# Altium schematic sheet USB.SchDoc
size A4; SheetNumber: 2; SheetTotal: 2
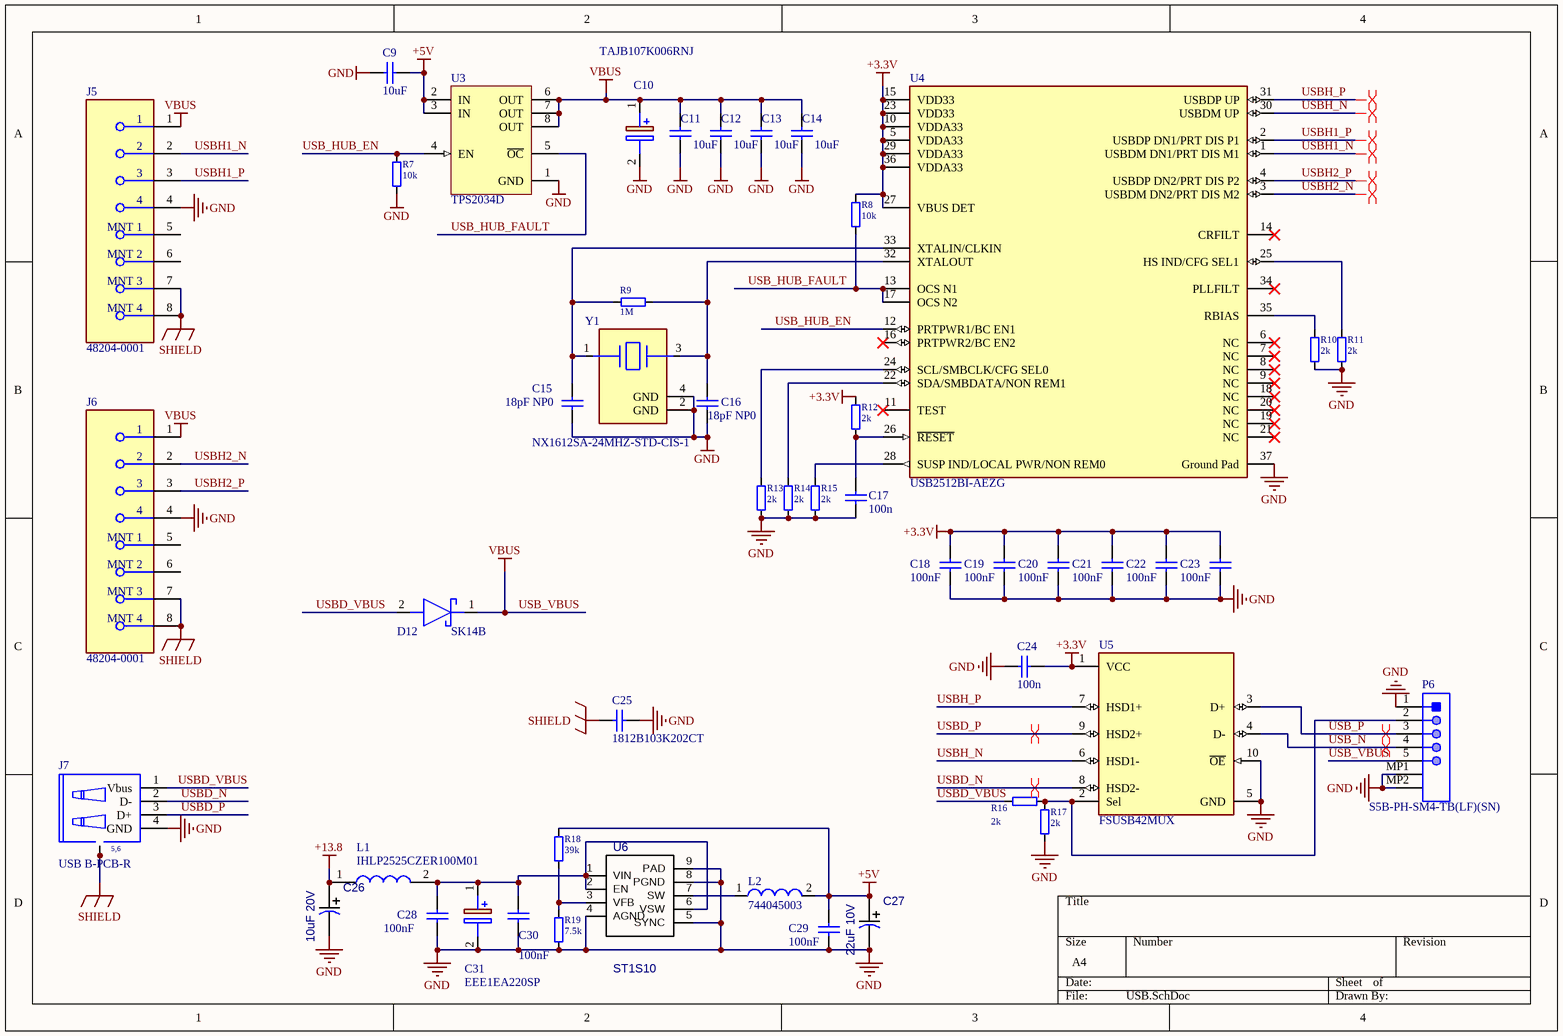
[diagram p0: USB.SchDoc]

## Parts
C9  10uF  [C-0805]
C10  TAJB107K006RNJ  [CAPPM3528X210N]
C11  10uF  [C-0805]
C12  10uF  [C-0805]
C13  10uF  [C-0805]
C14  10uF  [C-0805]
C15  18pF NP0  [C-0805]
C16  18pF NP0  [C-0805]
C17  100n  [C-0805]
C18  100nF  [C-0805]
C19  100nF  [C-0805]
C20  100nF  [C-0805]
C21  100nF  [C-0805]
C22  100nF  [C-0805]
C23  100nF  [C-0805]
C24  100n  [C-0805]
C25  1812B103K202CT  [CAPC4632X280X75LL50T35]
C26  10uF 20V  [CAPAE_4.3x4.3h5.4]
C27  22uF 10V  [CAPAE_4.3x4.3h5.4]
C28  100nF  [C-0805]
C29  100nF  [C-0805]
C30  100nF  [C-0805]
C31  EEE1EA220SP  [EEE1AA101SP]
D12  SK14B  [DIOM5236X261N]
J5  48204-0001  [FP-48204-0001-MFG]
J6  48204-0001  [FP-48204-0001-MFG]
J7  USB B-PCB-R  [USB_B_PCB_R]
L1  IHLP2525CZER100M01  [INDPM6965X300N]
L2  744045003  [WE-LQ-L]
P6  S5B-PH-SM4-TB(LF)(SN)  [JST-S5B-PH-SM4-TB_V]
R7  10k  [R-0805]
R8  10k  [R-0805]
R9  1M  [R-0805]
R10  2k  [R-0805]
R11  2k  [R-0805]
R12  2k  [R-0805]
R13  2k  [R-0805]
R14  2k  [R-0805]
R15  2k  [R-0805]
R16  2k  [R-0805]
R17  2k  [R-0805]
R18  39k  [R-0805]
R19  7.5k  [R-0805]
U3  TPS2034D  [D0008A_N]
U4  USB2512BI-AEZG  [FP-USB2512BI-AEZG-MFG]
U5  FSUSB42MUX  [FP-846AP-MFG]
U6  ST1S10  [ST1S10]
Y1  NX1612SA-24MHZ-STD-CIS-1  [FP-NX3225GA-MFG]

## Nets
+3.3V: C18.1 C19.1 C20.1 C21.1 C22.1 C23.1 C24.2 R8.1 R12.2 U4.5(VDDA33) U4.10(VDDA33) U4.15(VDD33) U4.23(VDD33) U4.27(VBUS_DET) U4.29(VDDA33) U4.36(VDDA33) U5.1(VCC)
+5V: C9.1 C27.1(PLUS) C29.1 L2.2 R18.1 U3.2(IN) U3.3(IN)
+13.8: C26.1(PLUS) L1.1
GND: C9.2 C10.2(-) C11.2 C12.2 C13.2 C14.2 C15.1 C16.1 C17.1 C18.2 C19.2 C20.2 C21.2 C22.2 C23.2 C24.1 C25.2 C26.2(MINUS) C27.2(MINUS) C28.2 C29.2 C30.2 C31.2(-) J5.4 J6.4 J7.4(GND) P6.1 P6.MP1 P6.MP2 R7.1 R10.1 R11.1 R13.1 R14.1 R15.1 R17.1 R19.2 U3.1(GND) U4.37(Ground_Pad) U5.5(GND) U5.10(~{OE}) U6.4(AGND) U6.5(SYNC) U6.8(PGND) U6.9(PAD) Y1.2(GND) Y1.4(GND)
SHIELD: C25.1 J5.7(MNT_3) J5.8(MNT_4) J6.7(MNT_3) J6.8(MNT_4) J7.5 J7.6
USB_VBUS: C10.1(+) C11.1 C12.1 C13.1 C14.1 D12.1(K) J5.1 J6.1 P6.5 U3.6(OUT) U3.7(OUT) U3.8(OUT)  [also labelled VBUS]
USB_HUB_EN: R7.2 U3.4(EN) U4.12(PRTPWR1/BC_EN1)
USB_HUB_FAULT: R8.2 U3.5(~{OC}) U4.13(OCS_N1) U4.17(OCS_N2)
USB_N: P6.4 U5.4(D-)
USB_P: P6.3 U5.3(D+)
USBD_N: J7.2(D-) U5.8(HSD2-)
USBD_P: J7.3(D+) U5.9(HSD2+)
USBD_VBUS: D12.2(A) J7.1(Vbus) R16.2
USBH1_N: J5.2 U4.1(USBDM_DN1/PRT_DIS_M1)
USBH1_P: J5.3 U4.2(USBDP_DN1/PRT_DIS_P1)
USBH2_N: J6.2 U4.3(USBDM_DN2/PRT_DIS_M2)
USBH2_P: J6.3 U4.4(USBDP_DN2/PRT_DIS_P2)
USBH_N: U4.30(USBDM_UP) U5.6(HSD1-)
USBH_P: U4.31(USBDP_UP) U5.7(HSD1+)
NetC15_2: C15.2 R9.2 U4.33(XTALIN/CLKIN) Y1.1
NetC16_2: C16.2 R9.1 U4.32(XTALOUT) Y1.3
NetC17_2: C17.2 R12.1 U4.26(~{RESET})
NetC28_1: C28.1 C30.1 C31.1(+) L1.2 U6.1(VIN) U6.2(EN) U6.6(VSW)
NetL2_1: L2.1 U6.7(SW)
NetP6_2: P6.2 R16.1 R17.2 U5.2(Sel)
NetR10_2: R10.2 U4.35(RBIAS)
NetR11_2: R11.2 U4.25(HS_IND/CFG_SEL1)
NetR13_2: R13.2 U4.24(SCL/SMBCLK/CFG_SEL0)
NetR14_2: R14.2 U4.22(SDA/SMBDATA/NON_REM1)
NetR15_2: R15.2 U4.28(SUSP_IND/LOCAL_PWR/NON_REM0)
NetR18_2: R18.2 R19.1 U6.3(VFB)

Not connected (* = marked no-connect by the designer): J5 5(MNT_1) 6(MNT_2); J6 5(MNT_1) 6(MNT_2); U4 6(NC)* 7(NC)* 8(NC)* 9(NC)* 11(TEST)* 14(CRFILT)* 16(PRTPWR2/BC_EN2)* 18(NC)* 19(NC)* 20(NC)* 21(NC)* 34(PLLFILT)*

## Layout directives
differential pair: USB_N, USB_P, USBD_N, USBD_P, USBH1_N, USBH1_P, USBH2_N, USBH2_P, USBH_N, USBH_P

## Notes on the sheet
- (in symbol Conn USB 4P) 5,6

## Library data of the parts
C9 C11-C24 C28-C30 = C semi: Ceramic Multilayer Capacitor; Manufacturer: Yageo/Phycomp; Manufacturer P/N: CC0603JRNPO9BN102; numsch: 011; TypeNum: 155; Parameters: 1nF, NP0, 50V, ±5%; Tolerance: ±10%; Voltage: *
C10 = TAJB107K006RNJ: Capacitor Polarised; Manufacturer_Name: AVX; Datasheet Link: http://datasheets.avx.com/TAJ.pdf; Height: 2.1mm; Manufacturer_Part_Number: TAJB107K006RNJ; Mouser Part Number: 581-TAJB107K006R; Mouser Price/Stock: https://www.mouser.co.uk/ProductDetail/AVX/TAJB107K006RNJ?qs=fdqkYiOtZpcsxthKdBMg8Q%3D%3D; Arrow Part Number: TAJB107K006RNJ; Arrow Price/Stock: https://www.arrow.com/en/products/tajb107k006rnj/avx?region=nac
C25 = CMP-2000-05506-1: X7R ±10% 2kV 10nF 1812 Multilayer Ceramic Capacitors MLCC - SMD/SMT ROHS; Manufacturer: AVX; Rated Voltage: 1000V; Mounting Technology: SurfaceMount; Datasheet Version: 01/2016; Package Description: 2-Pin Surface Mount Device, Body 4.6 x 3.2 mm; Capacitance: 10nF; Dielectric: X7R; Manufacturer URL: http://www.avx.com/; Case Size/Dimension: 1812; Datasheet URL: http://datasheets.avx.com/HV-FlexitermMLCC.pdf; Package Reference: 1812; Tolerance (%): ±10%
C26 C27 = CAPAE_4.3x4.3h5.4
  C26: Value: 10uF 20V
  C27: Value: 22uF 10V
C31 = EEE1EA220SP: Capacitor Polarised; Manufacturer_Name: Panasonic; Datasheet Link: http://industrial.panasonic.com/cdbs/www-data/pdf/RDE0000/ABA0000C1145.pdf; Height: 7.8mm; Manufacturer_Part_Number: EEE1EA220SP
D12 = SK14B: Schottky Diode; Manufacturer_Name: Taiwan Semiconductor; Datasheet Link: https://datasheet.datasheetarchive.com/originals/distributors/Datasheets-35/DSA-697770.pdf; Height: 2.61mm; Manufacturer_Part_Number: SK14B; Mouser Part Number: 821-SK14B; Mouser Price/Stock: https://www.mouser.co.uk/ProductDetail/Taiwan-Semiconductor/SK14B?qs=tHU%2FlV7kTyTJWY0R1AZI9A%3D%3D
J5 J6 = CMP-0411-00001-3: CONN RCPT USB2.0 TYPEA 4POS R/A; Max Voltage Rating (DC): 3.03kV; Number of Contacts: 4; Current Rating: 1.5A; Voltage Rating: 30V; Connector Type: USB; Insulation Resistance: 1GR; Number of Ports: 1; Gender: Female; Pitch: 2mm; Min Operating Temperature: -55°C; Series: 48204; Number of Rows: 3; Length: 7.2mm; Package Quantity: 60; Contact Plating: Bronze; Termination: Solder; Voltage Rating (AC): 30V; Max Voltage Rating (AC): 30V; Depth: 19.25mm; Number of Circuits: 4; Flammability Rating: UL94 V-0; Contact Material: Tin; Housing Material: Polyester; Packaging: Tray; Color: Black; Orientation: Right Angle; Radiation Hardening: No; Number of Terminals/Pins: 4; Features: Shielded; Max Operating Temperature: 85°C; Weight: 0.09524oz
J7 = Conn USB 4P: Connector USB B-PCB-90 deg; Manufacturer: SST; Manufacturer P/N: USB-001-B; TypeNum: 820; Manufacturer No: *; Manufacturer No2: *; Manufacturer Link: *; Parameters: *
L1 = IHLP2525CZER100M01: Inductor; Manufacturer_Name: Vishay; Datasheet Link: https://www.vishay.com/docs/34104/ihlp-2525cz-01.pdf; Height: 3mm; Manufacturer_Part_Number: IHLP2525CZER100M01; Mouser Part Number: 70-IHLP2525CZER100M0; Mouser Price/Stock: https://www.mouser.co.uk/ProductDetail/Vishay-Dale/IHLP2525CZER100M01?qs=PA%252BPfIdQ8xl3JLrMc5InbA%3D%3D; Arrow Part Number: IHLP2525CZER100M01; Arrow Price/Stock: https://www.arrow.com/en/products/ihlp2525czer100m01/vishay?region=nac
L2 = CMP-0227-00587-1: SMD-RF-Inductor WE-LQ, L = 3.30 µH; Inductance: 3.30 ÂµH; ComponentLink2URL: http://www.we-online.de/katalog/media/pdf/744045003.pdf; ComponentLink2Description: Datasheet; PackageDescription: Inductor, 2-Leads, Body 4.5 x 3.2 mm; PackageReference: WE-LQ-L; DatasheetVersion: ver 3, Jul-2006; ComponentLink1URL: http://www.we-online.com; ComponentLink1Description: Manufacturer Link; PackageVersion: 2006
P6 = CMP-2000-07026-1: Male Header, Pitch 2 mm, 1 x 5 Position, Height 5.5 mm, -25 to 85 degC, RoHS, Tape and Reel; Manufacturer: JST; No of Positions: 5; Pitch: 2mm; Style/Orientation: RightAngleHeader/Plug; Manufacturer URL: http://www.jst.com/home2.html; Datasheet URL: http://www.jst-mfg.com/product/pdf/eng/ePH.pdf; Termination: Crimp; Mounting Technology: SurfaceMount; Package Reference: S5B-PH-SM4-TB; Type: WiretoBoard; Datasheet Version: 12/2012; Package Description: Male Header, Pitch 2 mm, 1 x 5 Position, Height 5.5 mm
R7-R19 = RES semi: Chip Resistor; Manufacturer: Yageo/Phycomp; Manufacturer P/N: RC0603FR-0749R9L; numsch: 021; TypeNum: 212; Parameters: 49.9R, RC, 0.1W, ±1%, TCR ±100ppm; Power: *; TCR: *; Series: *; Tolerance: *
U3 = CMP-0337-00092-2: 2.2 A, 2.7 to 5.5 V Single Hot-Swap IC Hi-Side MOSFET, Fault Report, Act-High Enable, 33 mOhms, -40 to 85 degC, 8-pin SOIC (D), Green (RoHS & no Sb/Br); Manufacturer: Texas Instruments; Enable: Active High; Number of Switches: 1; Vin(Max)(V): 5.5; Rating: Catalog; Vin(Min)(V): 2.7; rDS(on) per FET(Typ)(mOhms): 33; Current Limit(A): 3; Continuous Current(Max)(A): 2; PackageDescription: 8-Pin Plastic Small Outline Integrated Circuit, 4.9 x 3.9 mm, Pitch 1.27 mm Pitch; PackageReference: D0008A; Code_JEDEC: MS-012AA; DatasheetVersion: SLVS190C; ComponentLink1URL: http://www.ti.com/general/docs/lit/getliterature.tsp?genericPartNumber=TPS2034&fileType=pdf; Mounting Technology: Surface Mount; ComponentLink1Description: Datasheet; PartNumber: TPS2034D; PackageVersion: revM, Jun-2011; Eco-Plan: Green (RoHS & no Sb/Br)
U4 = CMP-06284-000006-1: IC USB 2.0 2PORT HUB CTLR 36QFN; Manufacturer: Microchip Technology; Interface: I2C,USB,SMBus; Max Supply Voltage: 3.6V; Standoff Height: 0mm; Number Of Ports: 2; Usb Standard: USB 2.0; Min Supply Voltage: 3V; Automotive: No; Temperature: -40°C to +85°C; Ambient Temperature Range Low: -40°C; Lead Free: Yes; RoHS: TRUE; Height: 1mm; Category: IC; ComponentLink2Description: Datasheet; Device Class L1: Integrated Circuits (ICs); Octopart: https://octopart.com/usb2512bi-aezg-microchip-24995415; Device Class L3: USB Interface ICs; Manufacturer Part Number: USB2512BI-AEZG; ComponentLink2URL: http://ww1.microchip.com/downloads/en/DeviceDoc/00001692C.pdf; Ipc Land Pattern Name: QFN50P600X600X90-36; Temperature Range Low: -40°C; Mouser Description: USB Interface IC USB2.0 HIGH SPEED IND HUB CONTROLLER; Ambient Temperature Range High: +85°C; Digikey Description: IC USB 2.0 2PORT HUB CTLR 36QFN; Temperature Range High: +85°C; Package: 0; Device Class L2: Interface ICs
U5 = CMP-07103-000004-1: IC USB SWITCH DPDT 10MSOP; Voltage: 4.3V; Current: 100mA; Number of Inputs: 2; Supply Type: Single; Number of Outputs: 4; Data Rate: 480Mbps; On-State Resistance: 6.5R; Min Supply Voltage: 3V; Package Quantity: 1; Length: 3mm; Radiation Hardening: No; Number of Pins: 10; Width: 3mm; Number of Channels: 2; REACH SVHC: No SVHC; Lead Free: Lead Free; Max Operating Temperature: 85°C; Min Operating Temperature: -40°C; Packaging: Tape and Reel; Throw Configuration: DPDT; Operating Supply Voltage: 4.3V; Max Supply Voltage: 4.3V; Mount: Surface Mount; Case/Package: MSOP; Weight: 0.1125g; Height: 0.85mm
Y1 = CMP-200220-000007-1: CRYSTAL 16.0000MHZ 8PF SMD; Frequency Stability: 30ppm; Frequency Tolerance: 20ppm; Frequency: 16MHz; ESR (Equivalent Series Resistance): 80R; Min Operating Temperature: -40°C; Mount: Surface Mount; Width: 0.098inch; Case/Package: SMD/SMT; Max Operating Temperature: 85°C; Number of Pins: 4; Length: 0.126inch; Load Capacitance: 8pF; Packaging: Tape and Reel; Package Quantity: 3000; Height: 0.035inch